# EasyEDA schematic postomatMainBoard_2021-04-18_15-55-46.json
TITLE: Sheet_1; REV: 1.0; Date: 2020-12-27; Sheet: 1/1; Drawn By: filinda; Company: Your Company
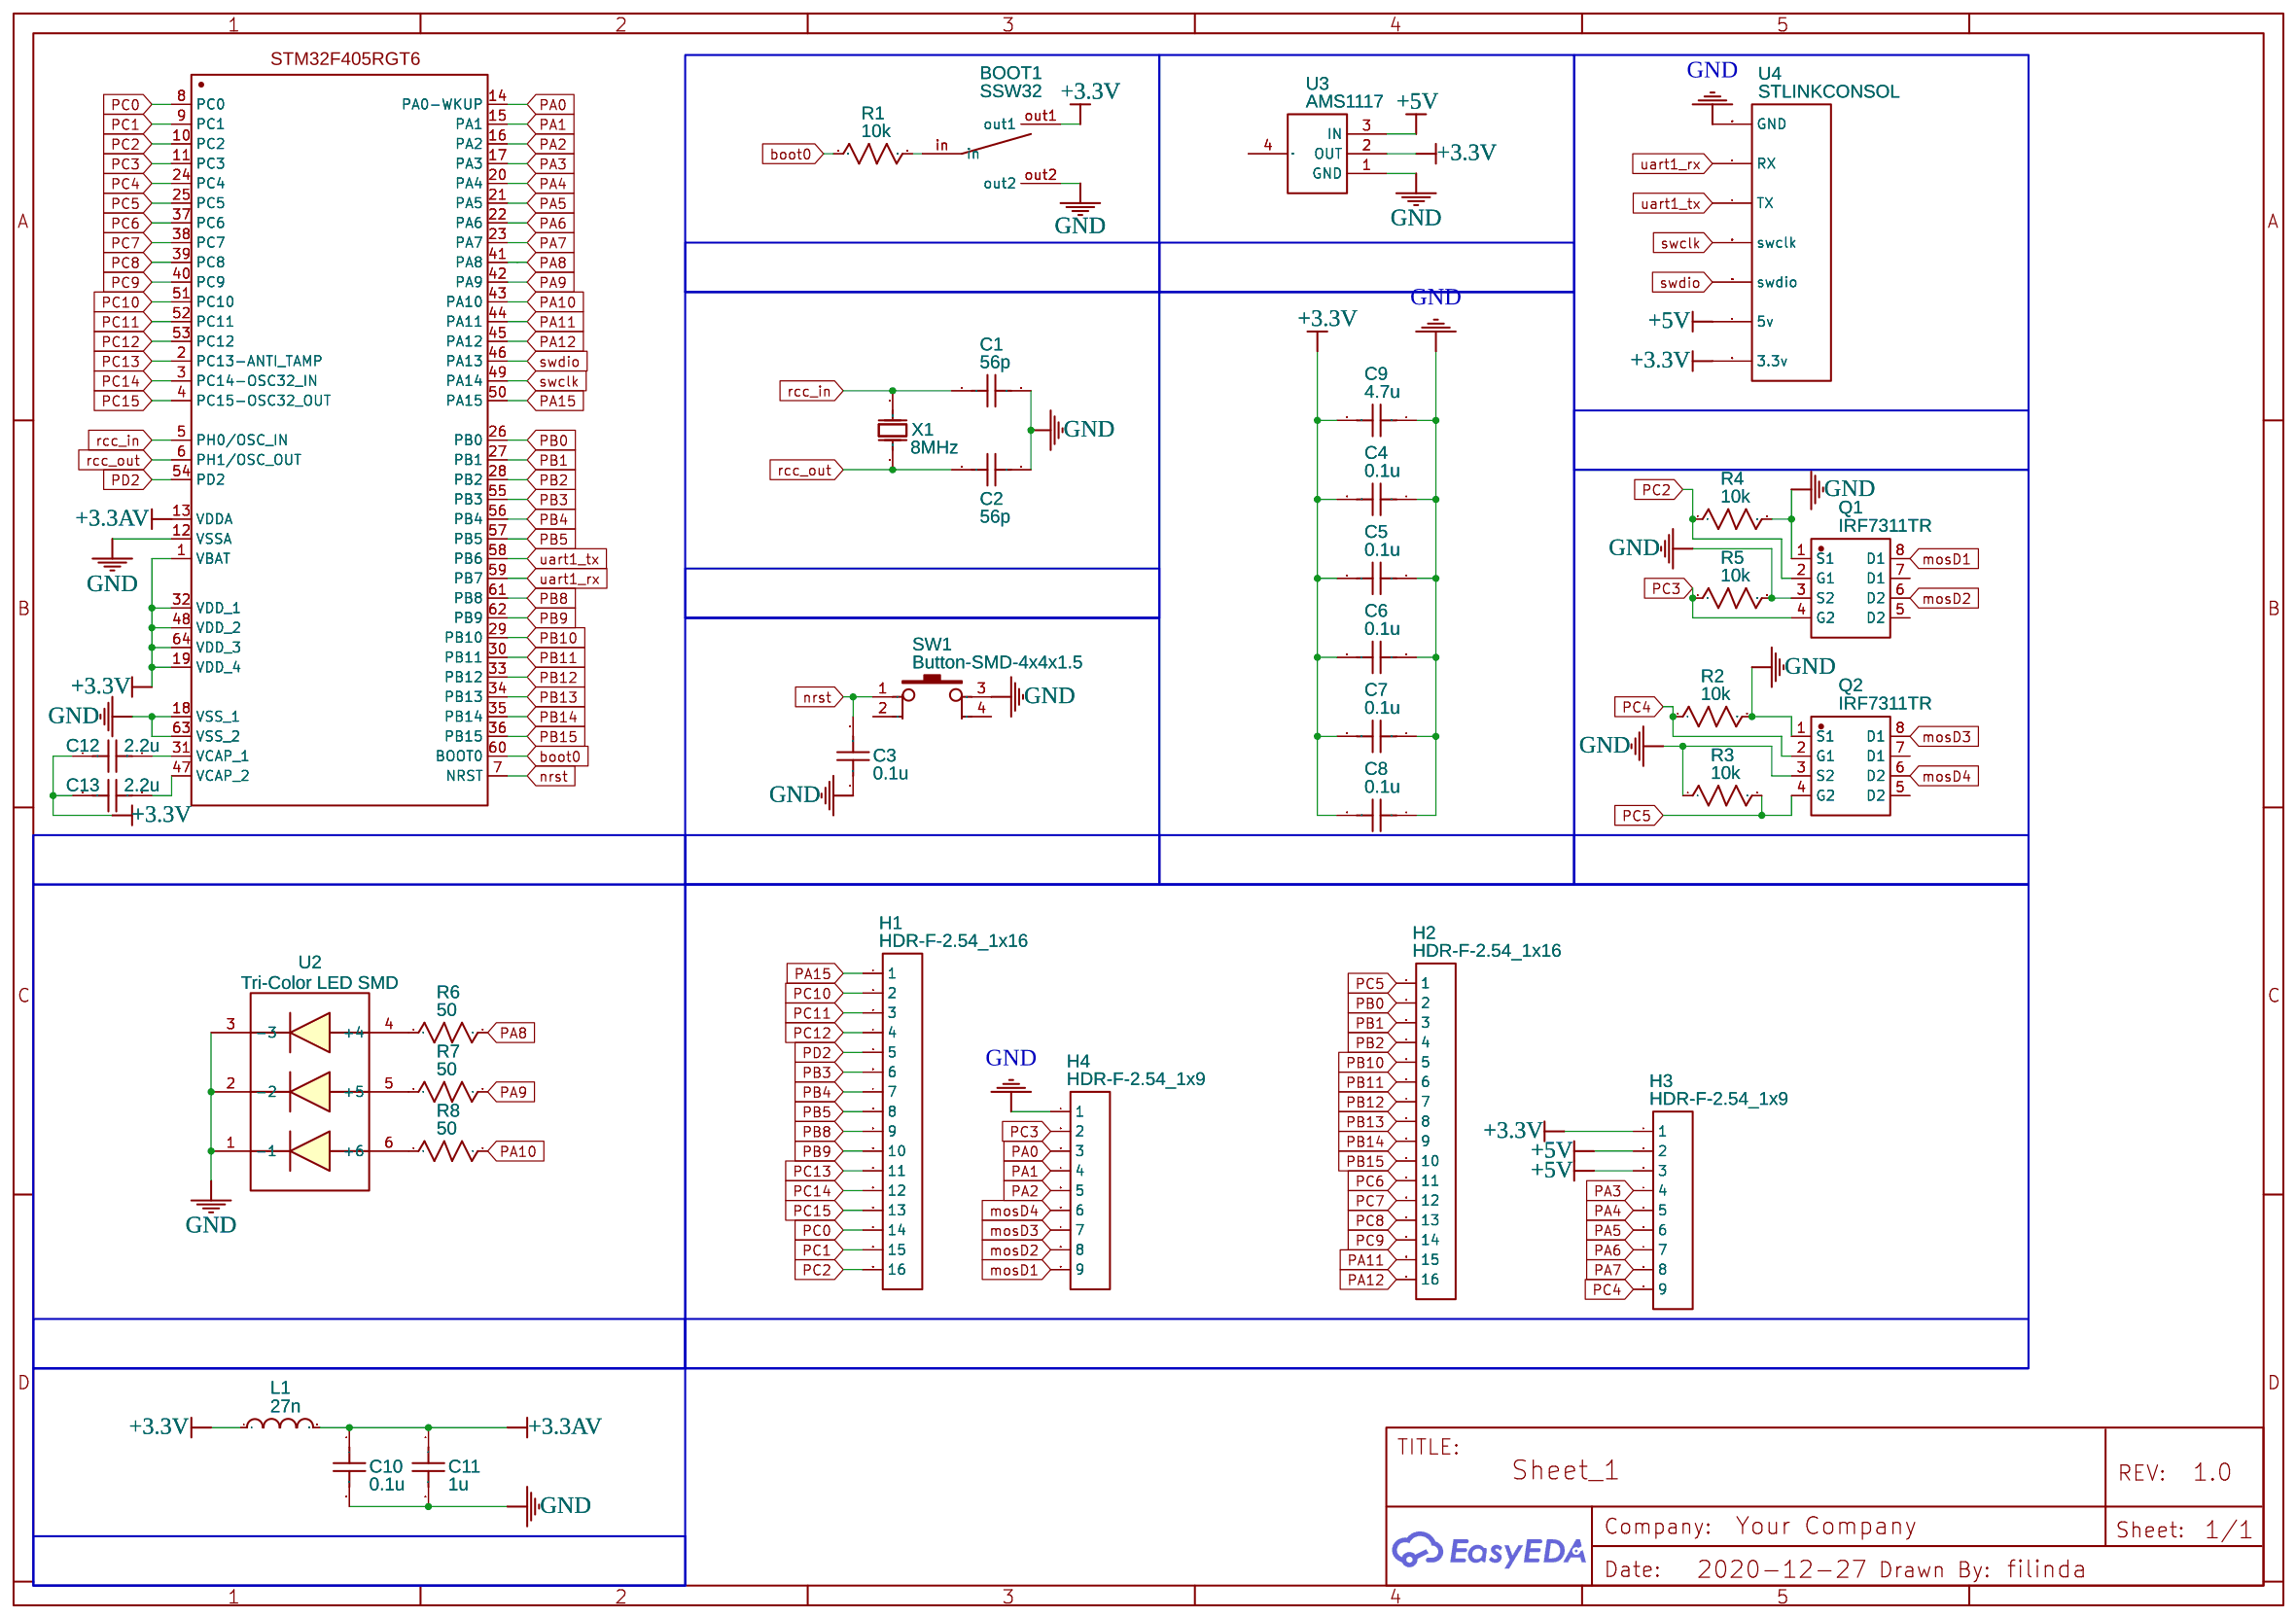
[diagram p0: schematic sheet]

## Parts
BOOT1  SSW32  [SSW32]
C1  56p  [C0805]
C2  56p  [C0805]
C3  0.1u  [C0603]
C4  0.1u  [C0603]
C5  0.1u  [C0603]
C6  0.1u  [C0603]
C7  0.1u  [C0603]
C8  0.1u  [C0603]
C9  4.7u  [C0603]
C10  0.1u  [C0603]
C11  1u  [C0603]
C12  2.2u  [C0603]
C13  2.2u  [C0603]
H1  HDR-F-2.54_1x16  [HDR-F-2.54_1X16]
H2  HDR-F-2.54_1x16  [HDR-F-2.54_1X16]
H3  HDR-F-2.54_1x9  [HDR-F-2.54_1X9]
H4  HDR-F-2.54_1x9  [HDR-F-2.54_1X9]
L1  27n  [L0805]
Q1  IRF7311TR  [SO-8_L4.9-W3.9-P1.27-LS5.9-BL]
Q2  IRF7311TR  [SO-8_L4.9-W3.9-P1.27-LS5.9-BL]
R1  10k  [R1206]
R2  10k  [R1206]
R3  10k  [R1206]
R4  10k  [R1206]
R5  10k  [R1206]
R6  50  [R1206]
R7  50  [R1206]
R8  50  [R1206]
SW1  Button-SMD-4x4x1.5  [SW-SMD_4PIN-L5.20-W5.20]
U1  STM32F405RGT6  [STM32F405RGT6_FOOTPRINT_MPE]
U2  Tri-Color LED SMD  [TRI-COLOR LED SMD FOOTPRINT]
U3  AMS1117  [AMS_1117_SOT223]
U4  STLINKCONSOL  [STLINKCONSOL]
X1  8MHz  [HC-49SMD]

## Library data of the parts
BOOT1 = SSW32: Contributor: filinda
C1 C2 = C_0805_US: Contributor: LCEDA_Lib
C3-C13 = C_0603_US: Contributor: LCEDA_Lib
H1 H2 = HDR-F-2.54_1x16: Supplier Part: C66987; Supplier: LCSC; Contributor: LCEDA_Lib
H3 H4 = HDR-F-2.54_1x9: Supplier Part: C124417; Supplier: LCSC; Contributor: LCEDA_Lib
L1 = L0805_US: Contributor: LCEDA_Lib
Q1 Q2 = IRF7311TR: Supplier: LCSC; Supplier Part: C693288; Manufacturer: VBsemi Elec; Contributor: LCSC; SMT Type: Extend; JLCPCB SMD: Yes
R1-R8 = R_1206_US: Contributor: LCEDA_Lib
SW1 = Button-SMD-4x4x1.5: Supplier Part: C71830; Supplier: LCSC; Manufacturer: BBJ; Manufacturer Part: 4*4*1.5Copper head,260G, 0.25mm,
U1 = STM32F405RGT6: Manufacturer: STM; link: https://www.chipdip.ru/product/stm32f405rgt6; Contributor: filinda
U2 = Tri-Color LED SMD: Manufacturer: Oasistek; Manufacturer Part: TO-5050BC-MRPBFGF; Supplier: Tayda Electronics; Supplier Part: A-4680; link: https://www.taydaelectronics.com/leds/smd-led/tri-color-led-smd-chip-ultra-bright-red-green-blue.html; Contributor: TunerFreak
U3 = AMS1117: Manufacturer: RoHS compliant; Supplier: LCSC; Contributor: jailer21
U4 = STLINKCONSOL: Contributor: filinda
X1 = HC-49SM8MHZ20PF30PPM: Supplier: LCSC; Manufacturer: TAE; Manufacturer Part: HC-49SM8MHz20pF30ppm; Supplier Part: C107426

## Nets
+3.3V: BOOT1.out1 C4.2 C5.2 C6.2 C7.2 C8.2 C9.2 C12.1 C13.1 H3.1 L1.1 U1.1(VBAT) U1.19(VDD_4) U1.32(VDD_1) U1.48(VDD_2) U1.64(VDD_3) U3.2(OUT) U4.3.3v
+5V: H3.2 H3.3 U3.3(IN) U4.5v
GND: BOOT1.out2 C1.2 C2.2 C3.1 C4.1 C5.1 C6.1 C7.1 C8.1 C9.1 C10.2 C11.2 H4.1 Q1.1(S1) Q1.3(S2) Q2.1(S1) Q2.3(S2) R2.2 R3.1 R4.2 R5.2 SW1.3 U1.12(VSSA) U1.18(VSS_1) U1.63(VSS_2) U2.1(-1) U2.2(-2) U2.3(-3) U3.1(GND) U4.GND
+3.3AV: C10.1 C11.1 L1.2 U1.13(VDDA)
boot0: R1.1 U1.60(BOOT0)
mosD1: H4.9 Q1.8(D1)
mosD2: H4.8 Q1.6(D2)
mosD3: H4.7 Q2.8(D1)
mosD4: H4.6 Q2.6(D2)
nrst: C3.2 SW1.1 U1.7(NRST)
PA0: H4.3 U1.14(PA0-WKUP)
PA1: H4.4 U1.15(PA1)
PA2: H4.5 U1.16(PA2)
PA3: H3.4 U1.17(PA3)
PA4: H3.5 U1.20(PA4)
PA5: H3.6 U1.21(PA5)
PA6: H3.7 U1.22(PA6)
PA7: H3.8 U1.23(PA7)
PA8: R6.2 U1.41(PA8)
PA9: R7.2 U1.42(PA9)
PA10: R8.2 U1.43(PA10)
PA11: H2.15 U1.44(PA11)
PA12: H2.16 U1.45(PA12)
PA15: H1.1 U1.50(PA15)
PB0: H2.2 U1.26(PB0)
PB1: H2.3 U1.27(PB1)
PB2: H2.4 U1.28(PB2)
PB3: H1.6 U1.55(PB3)
PB4: H1.7 U1.56(PB4)
PB5: H1.8 U1.57(PB5)
PB8: H1.9 U1.61(PB8)
PB9: H1.10 U1.62(PB9)
PB10: H2.5 U1.29(PB10)
PB11: H2.6 U1.30(PB11)
PB12: H2.7 U1.33(PB12)
PB13: H2.8 U1.34(PB13)
PB14: H2.9 U1.35(PB14)
PB15: H2.10 U1.36(PB15)
PC0: H1.14 U1.8(PC0)
PC1: H1.15 U1.9(PC1)
PC2: H1.16 Q1.2(G1) R4.1 U1.10(PC2)
PC3: H4.2 Q1.4(G2) R5.1 U1.11(PC3)
PC4: H3.9 Q2.2(G1) R2.1 U1.24(PC4)
PC5: H2.1 Q2.4(G2) R3.2 U1.25(PC5)
PC6: H2.11 U1.37(PC6)
PC7: H2.12 U1.38(PC7)
PC8: H2.13 U1.39(PC8)
PC9: H2.14 U1.40(PC9)
PC10: H1.2 U1.51(PC10)
PC11: H1.3 U1.52(PC11)
PC12: H1.4 U1.53(PC12)
PC13: H1.11 U1.2(PC13-ANTI_TAMP)
PC14: H1.12 U1.3(PC14-OSC32_IN)
PC15: H1.13 U1.4(PC15-OSC32_OUT)
PD2: H1.5 U1.54(PD2)
rcc_in: C1.1 U1.5(PH0/OSC_IN) X1.1(OSC1)
rcc_out: C2.1 U1.6(PH1/OSC_OUT) X1.2(OSC2)
swclk: U1.49(PA14) U4.swclk
swdio: U1.46(PA13) U4.swdio
uart1_rx: U1.59(PB7) U4.RX
uart1_tx: U1.58(PB6) U4.TX
Net-(BOOT1-in): BOOT1.in R1.2
Net-(C12-2): C12.2 U1.31(VCAP_1)
Net-(C13-2): C13.2 U1.47(VCAP_2)
Net-(R6-1): R6.1 U2.4(+4)
Net-(R7-1): R7.1 U2.5(+5)
Net-(R8-1): R8.1 U2.6(+6)

Not connected (* = marked no-connect by the designer): Q1 5(D2) 7(D1); Q2 5(D2) 7(D1); SW1 2 4; U3 4(GND)
